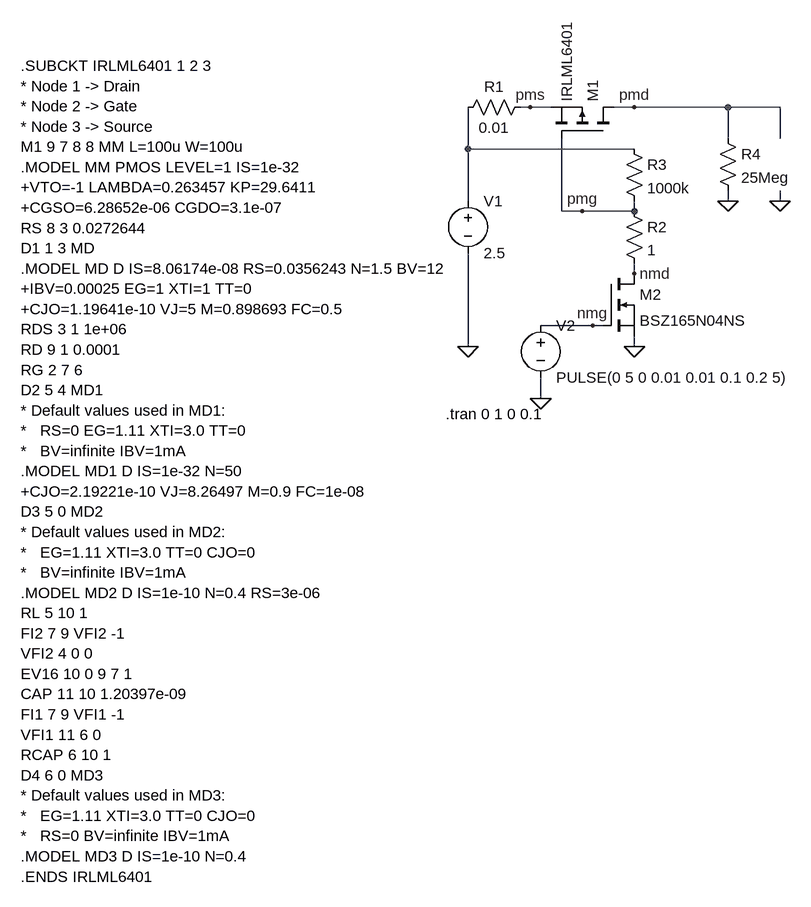
[diagram p0: schematic klucz_vbat_modulu.asc]
klucz_vbat_modulu.asc, the LTspice schematic file:
Version 4
SHEET 1 880 1492
WIRE 32 0 16 0
WIRE 64 0 32 0
WIRE 192 0 160 0
WIRE 336 0 192 0
WIRE 416 0 336 0
WIRE 336 48 336 0
WIRE 416 48 416 0
WIRE -64 64 -64 0
WIRE 192 64 -64 64
WIRE -64 144 -64 64
WIRE 336 144 336 128
WIRE 416 144 416 128
WIRE 80 160 80 48
WIRE 112 160 80 160
WIRE 192 160 192 144
WIRE 192 160 112 160
WIRE 192 256 192 240
WIRE 128 336 48 336
WIRE 144 336 128 336
WIRE -64 368 -64 224
WIRE 192 368 192 352
WIRE 48 448 48 416
FLAG 192 368 0
FLAG -64 368 0
FLAG 336 144 0
FLAG 48 448 0
FLAG 112 160 pmg
FLAG 32 0 pms
FLAG 192 0 pmd
FLAG 192 256 nmd
FLAG 128 336 nmg
FLAG 416 144 0
SYMBOL pmos 160 48 M270
SYMATTR InstName M1
SYMATTR Value IRLML6401
SYMATTR Prefix X
SYMBOL res 32 -16 R90
WINDOW 0 0 56 VBottom 2
WINDOW 3 32 56 VTop 2
SYMATTR InstName R1
SYMATTR Value 0.01
SYMBOL nmos 144 256 R0
SYMATTR InstName M2
SYMATTR Value BSZ165N04NS
SYMBOL res 176 144 R0
SYMATTR InstName R2
SYMATTR Value 1
SYMBOL res 176 48 R0
SYMATTR InstName R3
SYMATTR Value 1000k
SYMBOL voltage -64 128 R0
WINDOW 123 0 0 Left 2
WINDOW 39 24 124 Left 2
SYMATTR InstName V1
SYMATTR Value 2.5
SYMBOL voltage 48 320 R0
WINDOW 123 0 0 Left 2
WINDOW 39 0 0 Left 2
SYMATTR InstName V2
SYMATTR Value PULSE(0 5 0 0.01 0.01 0.1 0.2 5)
SYMBOL res 320 32 R0
SYMATTR InstName R4
SYMATTR Value 25Meg
TEXT -98 472 Left 2 !.tran 0 1 0 0.1
TEXT -752 -64 Left 2 !.SUBCKT IRLML6401 1 2 3\n* Node 1 -> Drain\n* Node 2 -> Gate\n* Node 3 -> Source\nM1 9 7 8 8 MM L=100u W=100u\n.MODEL MM PMOS LEVEL=1 IS=1e-32\n+VTO=-1 LAMBDA=0.263457 KP=29.6411\n+CGSO=6.28652e-06 CGDO=3.1e-07\nRS 8 3 0.0272644\nD1 1 3 MD\n.MODEL MD D IS=8.06174e-08 RS=0.0356243 N=1.5 BV=12\n+IBV=0.00025 EG=1 XTI=1 TT=0\n+CJO=1.19641e-10 VJ=5 M=0.898693 FC=0.5\nRDS 3 1 1e+06\nRD 9 1 0.0001\nRG 2 7 6\nD2 5 4 MD1\n* Default values used in MD1:\n*   RS=0 EG=1.11 XTI=3.0 TT=0\n*   BV=infinite IBV=1mA\n.MODEL MD1 D IS=1e-32 N=50\n+CJO=2.19221e-10 VJ=8.26497 M=0.9 FC=1e-08\nD3 5 0 MD2\n* Default values used in MD2:\n*   EG=1.11 XTI=3.0 TT=0 CJO=0\n*   BV=infinite IBV=1mA\n.MODEL MD2 D IS=1e-10 N=0.4 RS=3e-06\nRL 5 10 1\nFI2 7 9 VFI2 -1\nVFI2 4 0 0\nEV16 10 0 9 7 1\nCAP 11 10 1.20397e-09\nFI1 7 9 VFI1 -1\nVFI1 11 6 0\nRCAP 6 10 1\nD4 6 0 MD3\n* Default values used in MD3:\n*   EG=1.11 XTI=3.0 TT=0 CJO=0\n*   RS=0 BV=infinite IBV=1mA\n.MODEL MD3 D IS=1e-10 N=0.4\n.ENDS IRLML6401

The netlist it stands for:
* klucz_vbat_modulu.asc
XM1 pmd pmg pms IRLML6401  ; pins D G S
R1 pms N001 0.01
M2 nmd nmg 0 0 BSZ165N04NS
R2 pmg nmd 1
R3 N001 pmg 1000k
V1 N001 0 2.5
V2 nmg 0 PULSE(0 5 0 0.01 0.01 0.1 0.2 5)
R4 pmd 0 25Meg
.model NMOS NMOS
.model PMOS PMOS
.lib standard.mos
.tran 0 1 0 0.1
.SUBCKT IRLML6401 1 2 3
* Node 1 -> Drain
* Node 2 -> Gate
* Node 3 -> Source
M1 9 7 8 8 MM L=100u W=100u
.MODEL MM PMOS LEVEL=1 IS=1e-32
+VTO=-1 LAMBDA=0.263457 KP=29.6411
+CGSO=6.28652e-06 CGDO=3.1e-07
RS 8 3 0.0272644
D1 1 3 MD
.MODEL MD D IS=8.06174e-08 RS=0.0356243 N=1.5 BV=12
+IBV=0.00025 EG=1 XTI=1 TT=0
+CJO=1.19641e-10 VJ=5 M=0.898693 FC=0.5
RDS 3 1 1e+06
RD 9 1 0.0001
RG 2 7 6
D2 5 4 MD1
* Default values used in MD1:
*   RS=0 EG=1.11 XTI=3.0 TT=0
*   BV=infinite IBV=1mA
.MODEL MD1 D IS=1e-32 N=50
+CJO=2.19221e-10 VJ=8.26497 M=0.9 FC=1e-08
D3 5 0 MD2
* Default values used in MD2:
*   EG=1.11 XTI=3.0 TT=0 CJO=0
*   BV=infinite IBV=1mA
.MODEL MD2 D IS=1e-10 N=0.4 RS=3e-06
RL 5 10 1
FI2 7 9 VFI2 -1
VFI2 4 0 0
EV16 10 0 9 7 1
CAP 11 10 1.20397e-09
FI1 7 9 VFI1 -1
VFI1 11 6 0
RCAP 6 10 1
D4 6 0 MD3
* Default values used in MD3:
*   EG=1.11 XTI=3.0 TT=0 CJO=0
*   RS=0 BV=infinite IBV=1mA
.MODEL MD3 D IS=1e-10 N=0.4
.ENDS IRLML6401
.backanno
.end